# EasyEDA Pro project skyrizz_e32._se050-v1.1.epro, schematic Schematic1_8, sheets 5 to 6 of 6

## Sheets
5 BUTTON & IND: Page Name: BUTTON & IND; Update Date: 2026-05-07
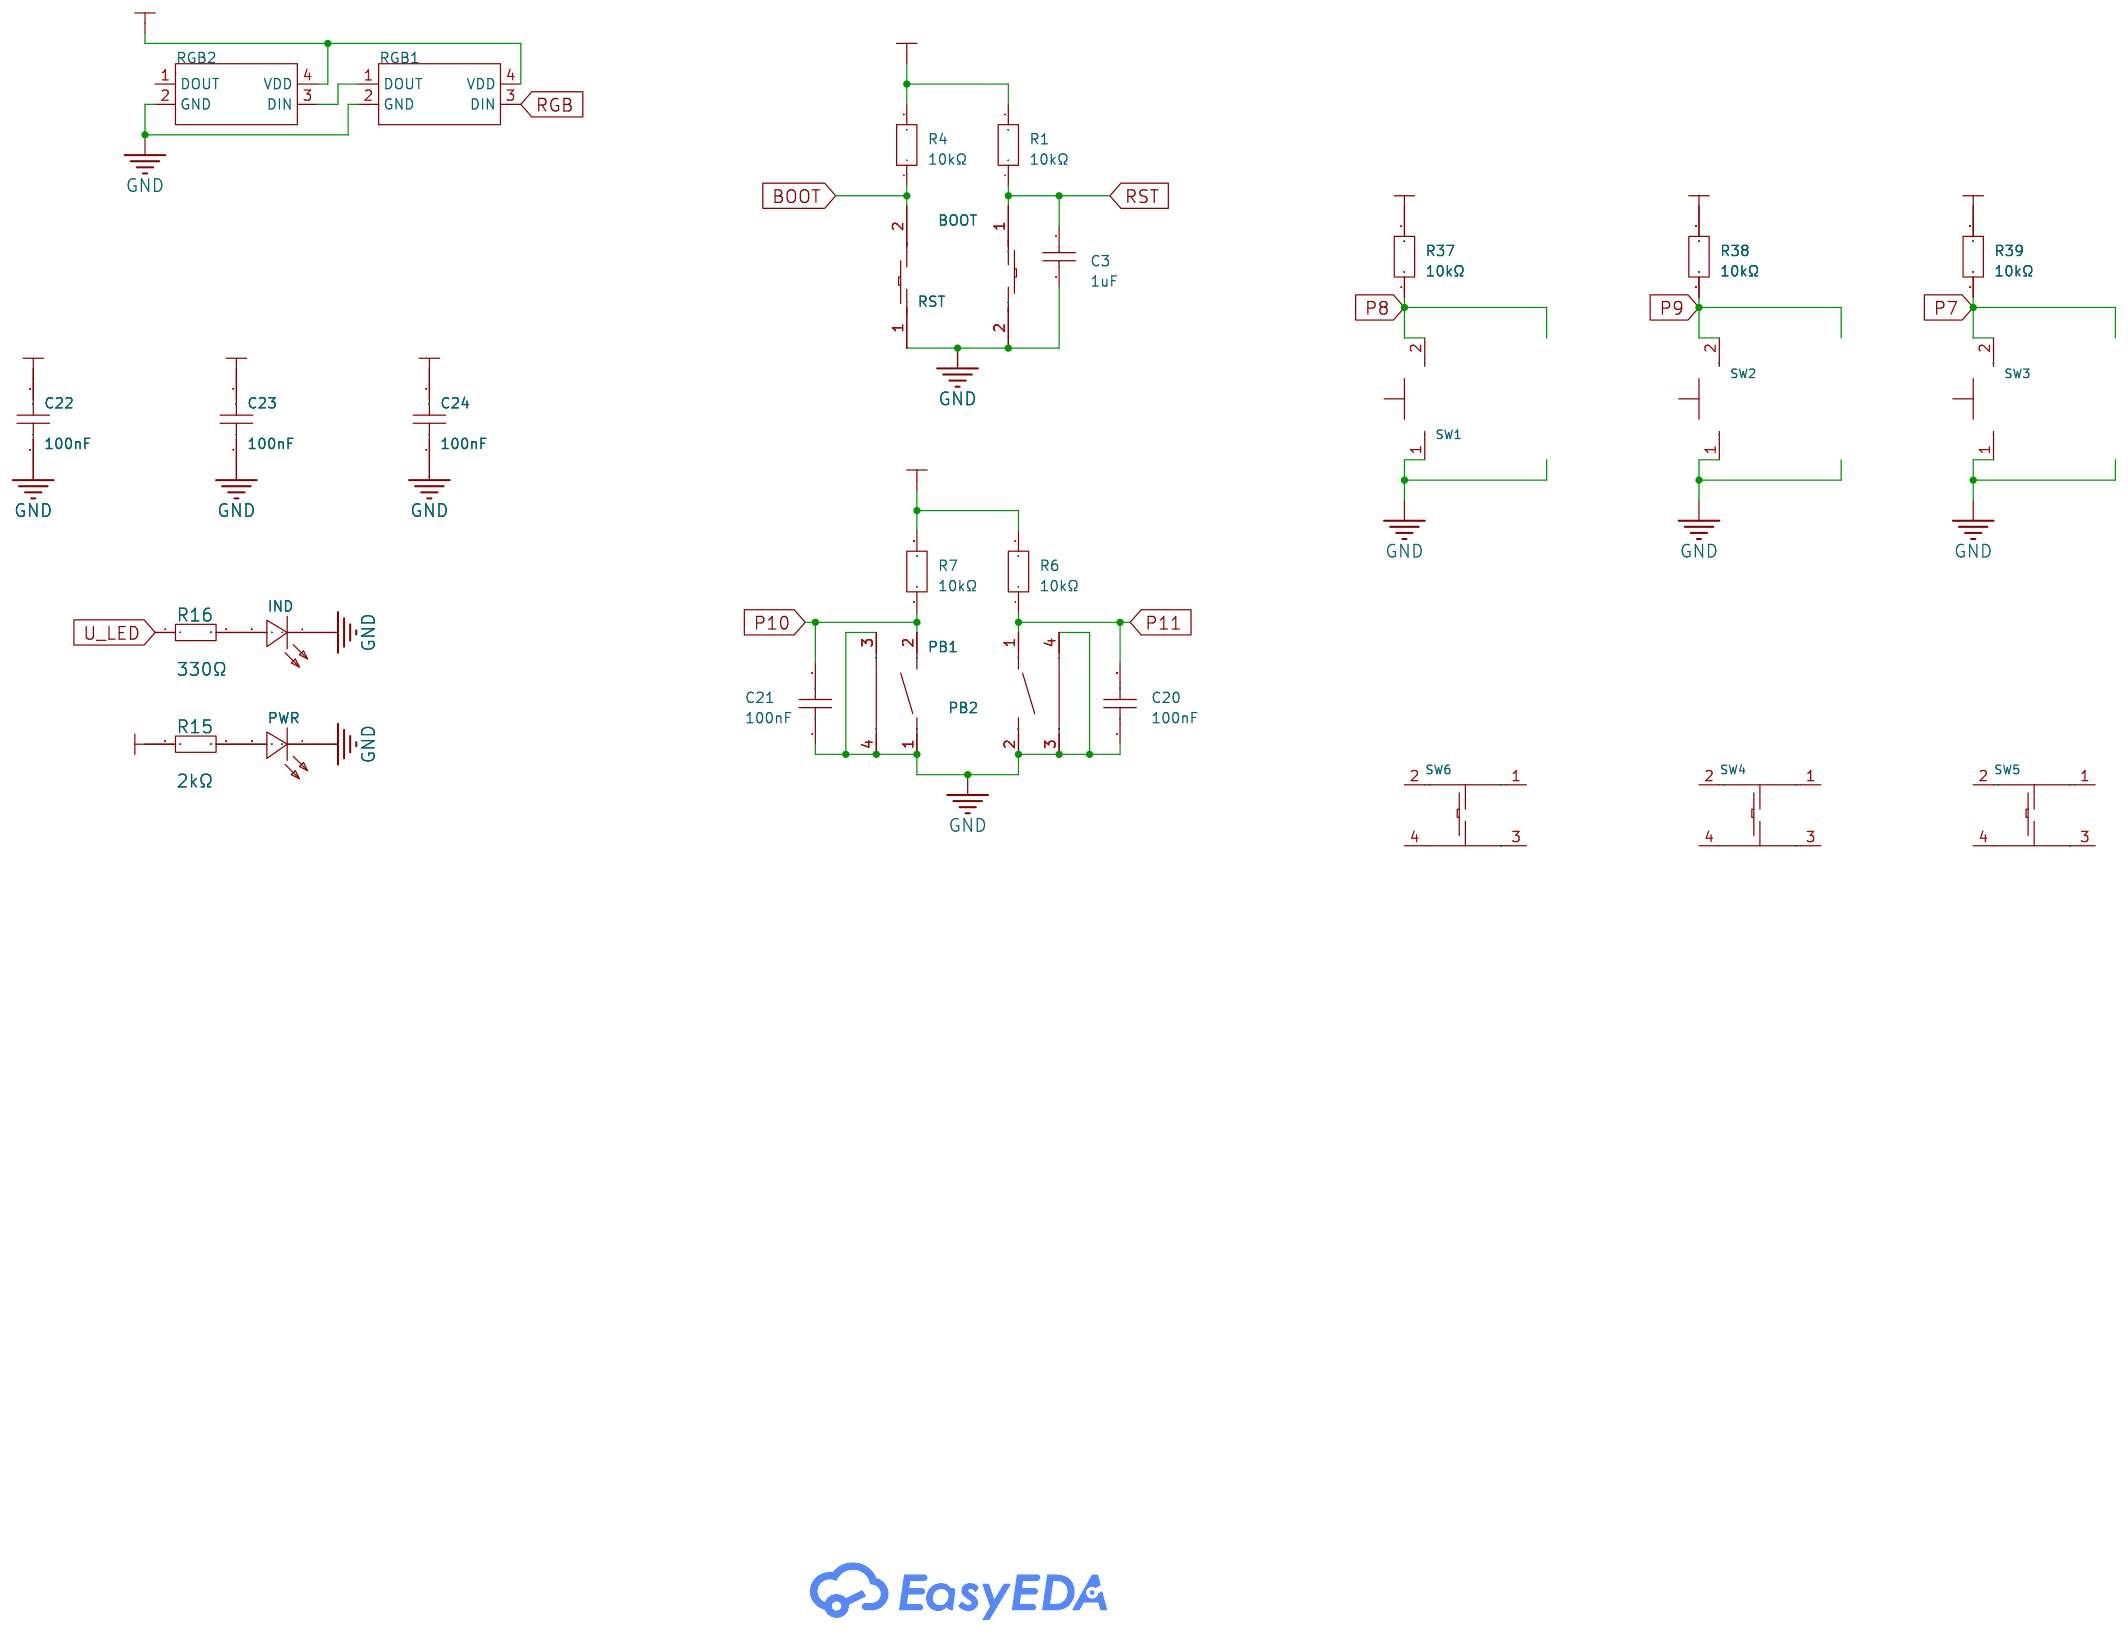
[diagram p4: BUTTON & IND]
6 MIC & SPEAKER: Page Name: MIC & SPEAKER; Update Date: 2026-05-03
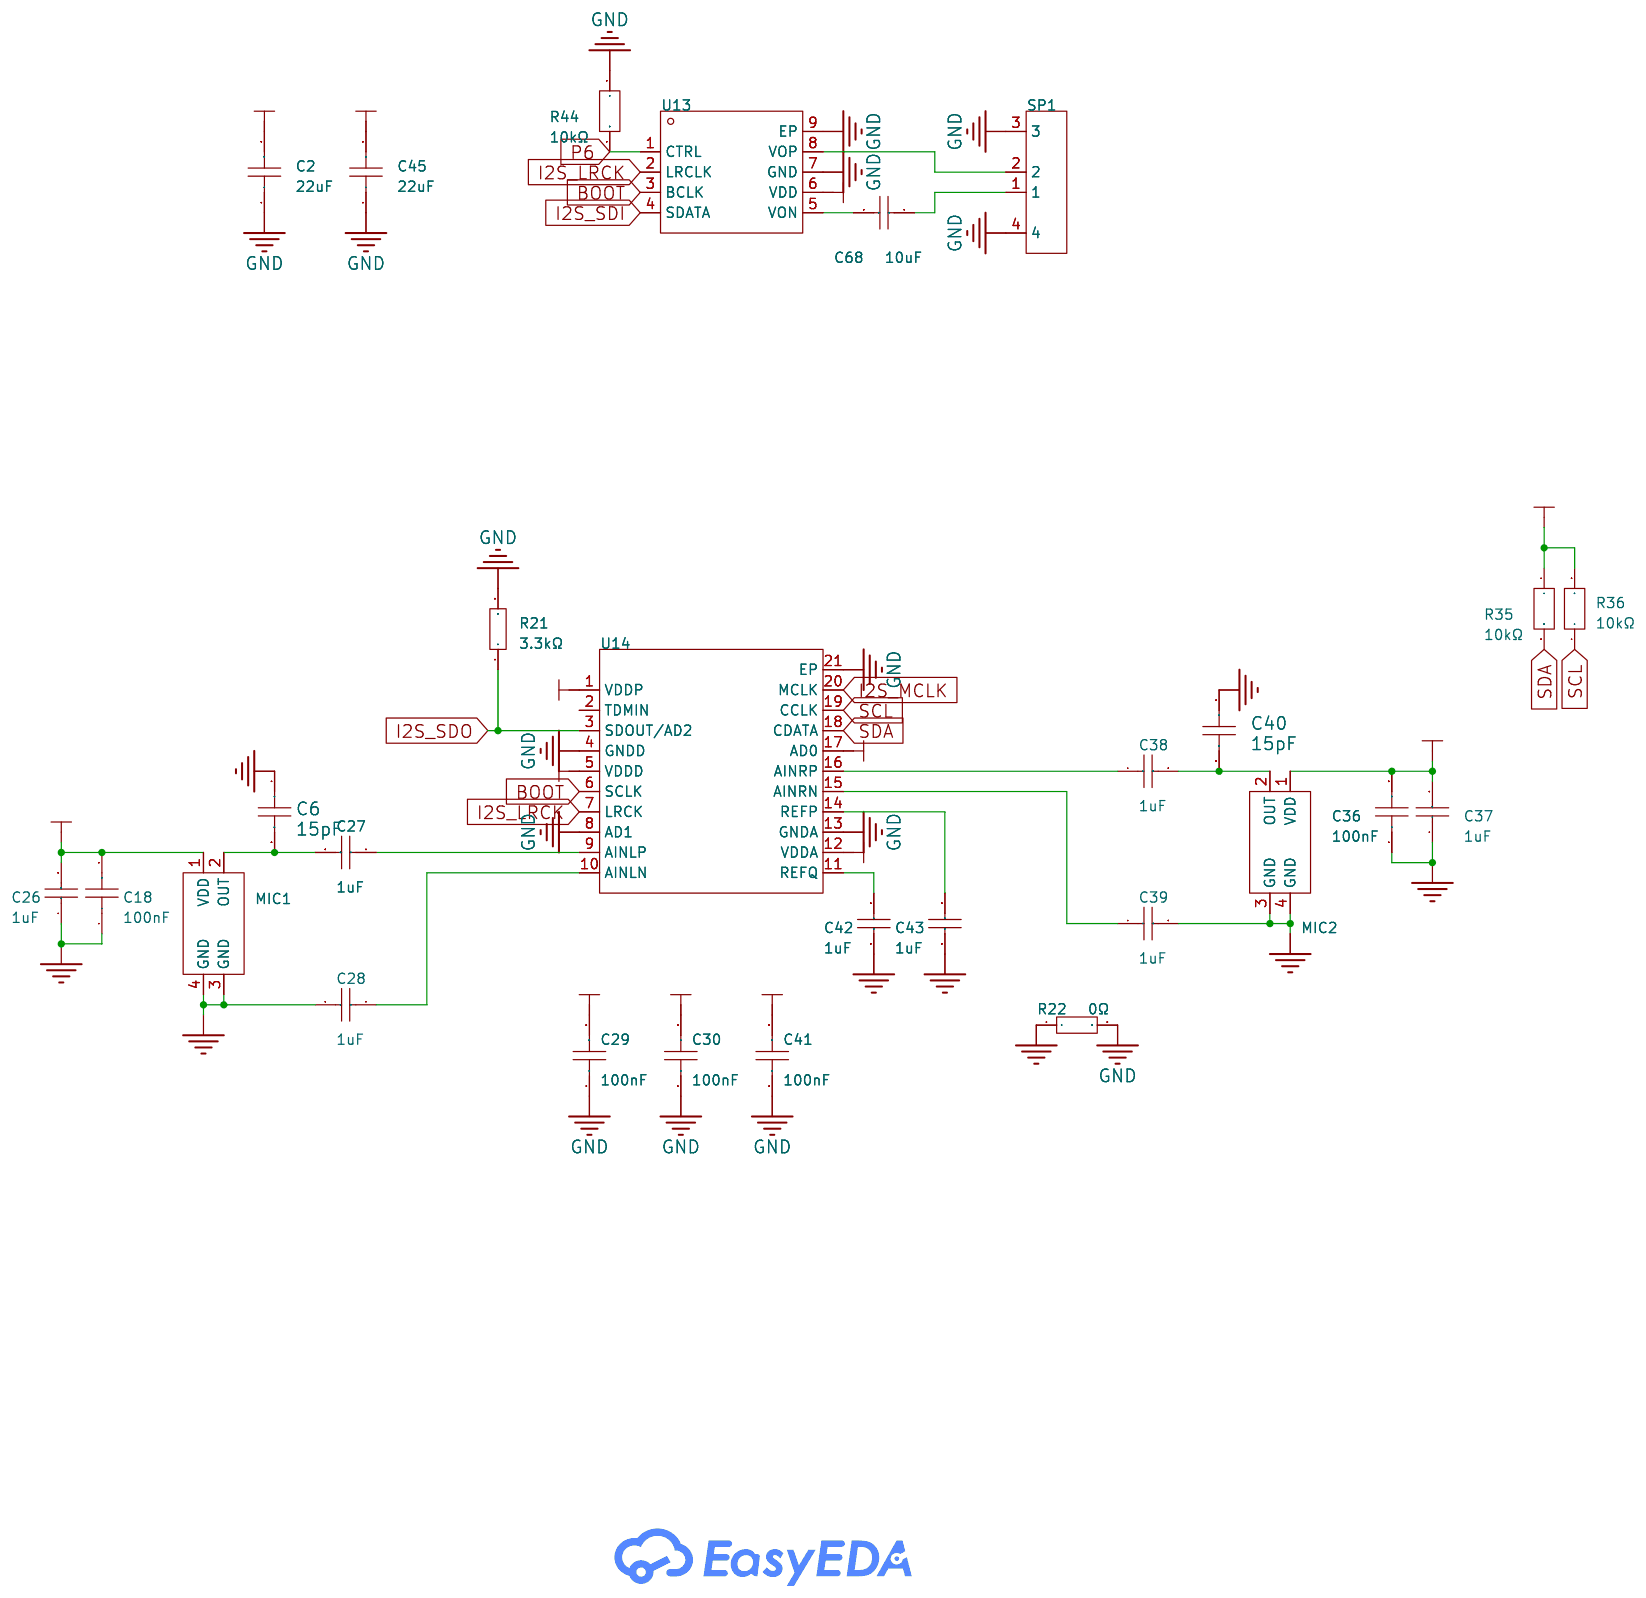
[diagram p5: MIC & SPEAKER]

## Parts
sheet BUTTON & IND
BOOT  B3U-1000P  [KEY-SMD_B3U-1000PM]
C3  1uF  [C0201]
C20  100nF  [C0201]
C21  100nF  [C0201]
C22  100nF  [C0201]
C23  100nF  [C0201]
C24  100nF  [C0201]
IND  KT-0603YG  [LED0603-RD]
PB1  TS24CA  [SW-SMD_2P-TS24CA]
PB2  TS24CA  [SW-SMD_2P-TS24CA]
PWR  KT-0603R  [LED0603-RD]
R1  10kΩ  [R0201]
R4  10kΩ  [R0201]
R6  10kΩ  [R0201]
R7  10kΩ  [R0201]
R15  2kΩ  [R0201]
R16  330Ω  [R0201]
R37  10kΩ  [R0201]
R38  10kΩ  [R0201]
R39  10kΩ  [R0201]
RGB1  XL-0807RGBC-2812B  [LED-SMD_4P-L2.0-W1.8_XL-0807RGBC-WS2812B]
RGB2  XL-0807RGBC-2812B  [LED-SMD_4P-L2.0-W1.8_XL-0807RGBC-WS2812B]
RST  B3U-1000P  [KEY-SMD_B3U-1000PM]
SW1  SKPMAPE010  [KEY-SMD_2P-L6.0-W6.0-P6.00]
SW2  SKPMAPE010  [KEY-SMD_2P-L6.0-W6.0-P6.00]
SW3  SKPMAPE010  [KEY-SMD_2P-L6.0-W6.0-P6.00]
SW4  EVQQ2B03W  [KEY-SMD_4P-L6.5-W6.0-P4.0-LS6.6]  (no BOM)
SW5  EVQQ2B03W  [KEY-SMD_4P-L6.5-W6.0-P4.0-LS6.6]  (no BOM)
SW6  EVQQ2B03W  [KEY-SMD_4P-L6.5-W6.0-P4.0-LS6.6]  (no BOM)
sheet MIC & SPEAKER
C2  22uF  [C0402]
C6  15pF  [C0201]
C18  100nF  [C0201]
C26  1uF  [C0201]
C27  1uF  [C0201]
C28  1uF  [C0201]
C29  100nF  [C0201]
C30  100nF  [C0201]
C36  100nF  [C0201]
C37  1uF  [C0201]
C38  1uF  [C0201]
C39  1uF  [C0201]
C40  15pF  [C0201]
C41  100nF  [C0201]
C42  1uF  [C0201]
C43  1uF  [C0201]
C45  22uF  [C0402]
C68  10uF  [C0402]
MIC1  MSM381ACP003  [MIC-SMD_4P-L2.8-W1.9-TR_MSM381ACP003]
MIC2  MSM381ACP003  [MIC-SMD_4P-L2.8-W1.9-TR_MSM381ACP003]
R21  3.3kΩ  [R0201]
R22  0Ω  [R0603]
R35  10kΩ  [R0201]
R36  10kΩ  [R0201]
R44  10kΩ  [R0201]
SP1  SM02B-SRSS-TB(LF)(SN)  [CONN-SMD_2P-P1.00_SM02B-SRSS-TB-LF-SN]
U13  NS4168  [ESOP-8_L4.9-W3.9-P1.27-LS6.0-BL-EP]
U14  ES7243E  [QFN-20_L3.0-W3.0-P0.40-BL-EP1.7]

## Library data of the parts
BOOT RST = B3U-1000P_C231329: Circuit:SPST Actuator Style:Round Button Operating Force:1.53N Mounting Type:Surface Mount,Vertical Length:3mm Width:2.5mm Switch Height:1.6mm Contact Current:50mA Voltage Rating:12V With Lamp:- Termination Style:SMD(SMT) Tab Life:- Operating Temperature:; LCSC Part Name: 3*2.5*1.6mm 立贴 轻触开关; Supplier Part: C231329; Manufacturer: OMRON(欧姆龙); Supplier Footprint: SMD,2.5x3mm; JLCPCB Part Class: Extended Part; Datasheet: https://item.szlcsc.com/datasheet/B3U-1000P/231216.html; Supplier: LCSC; Circuit: SPST; Actuator Style: Round Button; Operating Force: 1.53N; Mounting Type: Surface Mount,Vertical; Length: 3mm; Width: 2.5mm; Switch Height: 1.6mm; Contact Current: 50mA; Voltage Rating: 12V; Termination Style: SMD(SMT) Tab; Operating Temperature: -25℃~+70℃
C3 C26-C28 C37-C39 C42 C43 = CL03A105MQ3CSNH: Capacitance:1uF Tolerance:±20% Tolerance:±20% Voltage Rating:6.3V Temperature Coefficient:X5R; LCSC Part Name: 1uF ±20% 6.3V; Supplier Part: C53067; Manufacturer: SAMSUNG(三星); Supplier Footprint: 0201; JLCPCB Part Class: Extended Part; Datasheet: https://item.szlcsc.com/datasheet/CL03A105MQ3CSNH/54083.html; Supplier: LCSC; Tolerance: ±20%; Voltage Rating: 6.3V; Temperature Coefficient: X5R
C18 C20-C24 C29 C30 C36 C41 = CL03A104KP3NNNC: Capacitance:100nF Tolerance:±10% Tolerance:±10% Voltage Rating:10V Temperature Coefficient:X5R; LCSC Part Name: 100nF ±10% 10V; Supplier Part: C49062; Manufacturer: SAMSUNG(三星); Supplier Footprint: 0201; JLCPCB Part Class: Extended Part; Datasheet: https://item.szlcsc.com/datasheet/CL03A104KP3NNNC/50070.html; Supplier: LCSC; Tolerance: ±10%; Voltage Rating: 10V; Temperature Coefficient: X5R
IND = KT-0603YG: Lamp Holder Type:- Illumination Color:Yellow Green Voltage - Forward(Vf):2V~2.2V Voltage - Forward(Vf):2V~2.2V Power(Watts):40mW Forward Current:20mA Wavelength - Dominant:567nm~573nm Wavelength - Dominant:567nm~573nm Peak Wavelength:- Diode Configuration; LCSC Part Name: 0603 黄绿 普绿; Supplier Part: C2289; Manufacturer: KENTO; Supplier Footprint: 0603; JLCPCB Part Class: Extended Part; Datasheet: https://item.szlcsc.com/datasheet/KT-0603YG/2662.html; Supplier: LCSC; Illumination Color: Yellow Green; Voltage - Forward(Vf): 2V~2.2V; Power(Watts): 40mW; Forward Current: 20mA; Wavelength - Dominant: 567nm~573nm; Diode Configuration: Discrete Diode; Lens Color: Water Clear; Luminous Intensity: 30mcd~42mcd; Viewing Angle: 120°; Mounting Style: op View Mount; Operating Temperature: -40℃~+85℃
PB1 PB2 = TS24CA: Circuit:SPST Actuator Style:Rectangular Button Mounting Type:Surface Mount, Right Angle Length:4.55mm Width:1.8mm Switch Height:3.5mm Contact Current:50mA Voltage Rating:12V With Lamp:- Life:-; LCSC Part Name: 4.55*1.8*3.5mm 卧贴 轻触开关; Supplier Part: C393942; Manufacturer: SHOU HAN(首韩); Supplier Footprint: SMD,4.6x1.8mm; JLCPCB Part Class: Extended Part; Datasheet: https://item.szlcsc.com/datasheet/TS24CA/372554.html; Supplier: LCSC; Circuit: SPST; Actuator Style: Rectangular Button; Mounting Type: Surface Mount, Right Angle; Length: 4.55mm; Width: 1.8mm; Switch Height: 3.5mm; Contact Current: 50mA; Voltage Rating: 12V
PWR = KT-0603R: Emitted Color:Red Power Dissipation:- Forward Current:- Dominant Wavelength:- Dominant Wavelength:- Peak Wavelength:- Diode Configuration:- Lens Color:- Color Temperature:- Color Temperature:- Viewing Angle:- Mounting Sytle:- Operating Temperature:-40℃~+8; LCSC Part Name: 0603 红灯 高亮; Supplier Part: C2286; Manufacturer: KENTO; Supplier Footprint: 0603; JLCPCB Part Class: Basic Part; Datasheet: https://atta.szlcsc.com/upload/public/pdf/source/20160616/1466072038404.pdf; Supplier: LCSC; Emitted Color: Red; Operating Temperature: -40℃~+85℃
R1 R4 R6 R7 R35-R39 R44 = 0201WMF1002TEE: Type:Thick Film Resistors Resistance:10kΩ Tolerance:±1% Tolerance:±1% Power(Watts): Overload Voltage (Max): Temperature Coefficient:±200ppm/℃ Temperature Coefficient:±200ppm/℃ Operating Temperature Range:-55℃~+155℃ Operating Temperature Range:-55℃~+155℃; LCSC Part Name: 10kΩ ±1% 50mW 厚膜电阻; Supplier Part: C473048; Manufacturer: UNI-ROYAL(厚声); Supplier Footprint: 0201; JLCPCB Part Class: Extended Part; Datasheet: https://atta.szlcsc.com/upload/public/pdf/source/20200306/C422600_1E6D84923E4A46A82E41ADD87F860B5C.pdf; Supplier: LCSC; Type: Thick Film Resistors; Tolerance: ±1%; Temperature Coefficient: ±200ppm/℃; Operating Temperature Range: -55℃~+155℃
R15 = 0201WMF2001TEE: Type:Thick Film Resistor Resistance:2kΩ Tolerance:±1% Tolerance:±1% Power(Watts):50mW Voltage-Supply(Max):25V Temperature Coefficient:±200ppm/℃ Temperature Coefficient:±200ppm/℃ Operating Temperature:-55℃~+155℃ Operating Temperature:-55℃~+155℃; LCSC Part Name: 2kΩ ±1% 50mW 厚膜电阻; Supplier Part: C270358; Manufacturer: UNI-ROYAL(厚声); Supplier Footprint: 0201; JLCPCB Part Class: Extended Part; Datasheet: https://item.szlcsc.com/datasheet/0201WMF2001TEE/259888.html; Supplier: LCSC; Type: Thick Film Resistor; Tolerance: ±1%; Power(Watts): 50mW; Voltage-Supply(Max): 25V; Temperature Coefficient: ±200ppm/℃; Operating Temperature: -55℃~+155℃
R16 = 0201WMJ0331TEE: Type:Thick Film Resistors Resistance: Tolerance:±5% Tolerance:±5% Power(Watts): Overload Voltage (Max): Temperature Coefficient:±200ppm/℃ Temperature Coefficient:±200ppm/℃ Operating Temperature Range:-55℃~+155℃ Operating Temperature Range:-55℃~+155℃; LCSC Part Name: 330Ω ±5% 50mW 厚膜电阻; Supplier Part: C473445; Manufacturer: UNI-ROYAL(厚声); Supplier Footprint: 0201; JLCPCB Part Class: Extended Part; Datasheet: https://atta.szlcsc.com/upload/public/pdf/source/20200306/C422600_1E6D84923E4A46A82E41ADD87F860B5C.pdf; Supplier: LCSC; Type: Thick Film Resistors; Tolerance: ±5%; Temperature Coefficient: ±200ppm/℃; Operating Temperature Range: -55℃~+155℃
RGB1 RGB2 = XL-0807RGBC-2812B: Wavelength:R:620nm~630nm；G:520nm~530nm；B:460nm~475nm Luminous Intensity:R:200mcd；G:800mcd；B:300mcd Fixed-Frequency Pwm Mode:4.5kHz Data Transmission Rate:800Kbit/s Voltage - Supply:4V~5.5V Voltage - Supply:4V~5.5V Quiescent Current:0.35mA Lens Color:Water; LCSC Part Name: XL-0807RGBC-WS2812B; Supplier Part: C3646929; Manufacturer: XINGLIGHT(成兴光); Supplier Footprint: SMD-4P,2x1.8mm; JLCPCB Part Class: Extended Part; Datasheet: https://item.szlcsc.com/datasheet/XL-0807RGBC-2812B/4213772.html; Supplier: LCSC; Wavelength: R:620nm~630nm；G:520nm~530nm；B:460nm~475nm; Luminous Intensity: R:200mcd；G:800mcd；B:300mcd; Fixed-Frequency Pwm Mode: 4.5kHz; Data Transmission Rate: 800Kbit/s; Voltage - Supply: 4V~5.5V; Quiescent Current: 0.35mA; Lens Color: Water Clear; ESD Withstand Voltage: 3000V; Installation method: op View Mount; Operating Temperature: -20℃~+85℃; Peak Wavelength: R:625nm；B:470nm；G:525nm; Viewing Angle: 120°; Length: 2mm; Width: 0.8mm; Height: 1.8mm
SW1-SW3 = SKPMAPE010_C110292: Circuit:SPST Actuator Style:Round Button Mounting Style:Brick nogging Switch Length:6mm Switch Width:5.9mm Switch Height:5mm Contact Current:50mA Voltage Rating (DC):16V With Lamp:- Mechanical Life:-; LCSC Part Name: 6*5.9*5mm 立贴 轻触开关; Supplier Part: C110292; Manufacturer: ALPSALPINE(阿尔卑斯阿尔派); Supplier Footprint: SMD; JLCPCB Part Class: Extended Part; Datasheet: https://atta.szlcsc.com/upload/public/pdf/source/20170428/1493376812340.pdf; Supplier: LCSC; Circuit: SPST; Actuator Style: Round Button; Mounting Style: Brick nogging; Switch Length: 6mm; Switch Width: 5.9mm; Switch Height: 5mm; Contact Current: 50mA; Voltage Rating (DC): 16V
SW4-SW6 = EVQQ2B03W: Circuit:SPST Actuator Style:Round Button Operating Force:0.5N Mounting Style:Brick nogging Switch Length:6.5mm Switch Width:6mm Switch Height:3.1mm Contact Current:20mA Voltage Rating (AC):- Voltage Rating (DC):15V Power Rating:- Insulation Resistance:100; LCSC Part Name: 6.5*6*3.1mm 立贴 轻触开关; Supplier Part: C79178; Manufacturer: PANASONIC(松下); Supplier Footprint: SMD,6x6.5mm; JLCPCB Part Class: Extended Part; Datasheet: https://atta.szlcsc.com/upload/public/pdf/source/20160718/1468827520784.pdf; Supplier: LCSC; Circuit: SPST; Actuator Style: Round Button; Operating Force: 0.5N; Mounting Style: Brick nogging; Switch Length: 6.5mm; Switch Width: 6mm; Switch Height: 3.1mm; Contact Current: 20mA; Voltage Rating (DC): 15V; Insulation Resistance: 100MΩ; Pin Style: J pin; Mechanical Life: 200万次; Operating Temperature: -40℃~+85℃
C2 C45 = CL05A226MQ5QUNC: Capacitance:22uF Tolerance:±20% Tolerance:±20% Voltage Rating:6.3V Temperature Coefficient:X5R; LCSC Part Name: 22uF ±20% 6.3V; Supplier Part: C105226; Manufacturer: SAMSUNG(三星); Supplier Footprint: 0402; JLCPCB Part Class: Extended Part; Datasheet: https://item.szlcsc.com/datasheet/CL05A226MQ5QUNC/106441.html; Supplier: LCSC; Tolerance: ±20%; Voltage Rating: 6.3V; Temperature Coefficient: X5R
C6 C40 = GRM0335C1H150JA01D: Capacitance:15pF Tolerance:±5% Tolerance:±5% Voltage Rating:50V Temperature Coefficient:C0G; LCSC Part Name: 15pF ±5% 50V; Supplier Part: C85891; Manufacturer: muRata(村田); Supplier Footprint: 0201; JLCPCB Part Class: Extended Part; Datasheet: https://item.szlcsc.com/datasheet/GRM0335C1H150JA01D/87067.html; Supplier: LCSC; Tolerance: ±5%; Voltage Rating: 50V; Temperature Coefficient: C0G
C68 = CL05A106MQ5NUNC: Capacitance:10uF Tolerance:±20% Tolerance:±20% Voltage Rating:6.3V Temperature Coefficient:X5R; LCSC Part Name: 10uF ±20% 6.3V; Supplier Part: C15525; Manufacturer: SAMSUNG(三星); Supplier Footprint: 0402; JLCPCB Part Class: Basic Part; Datasheet: https://item.szlcsc.com/datasheet/CL05A106MQ5NUNC/16204.html; Supplier: LCSC; Tolerance: ±20%; Voltage Rating: 6.3V; Temperature Coefficient: X5R
MIC1 MIC2 = MSM381ACP003_C51928212: Direction:Omnidirectional Voltage - Supply:1.8V Voltage - Supply:1.8V Current Consumption:175uA Current Consumption:175uA S/N Ratio:64dB Sensitivity:-38dB Sensitivity:-38dB Impedance:170Ω Output Type:Analog output Length:2.75mm Width:1.85mm Height:1mm; Supplier Part: C51928212; Manufacturer: MEMS(敏芯微); Supplier Footprint: LGA-4(1.9x2.8); JLCPCB Part Class: Extended Part; Datasheet: https://item.szlcsc.com/datasheet/MSM381ACP003/54640767.html; Supplier: LCSC; Direction: Omnidirectional; Voltage - Supply: 1.8V; Current Consumption: 175uA; S/N Ratio: 64dB; Sensitivity: -38dB; Impedance: 170Ω; Output Type: Analog output; Length: 2.75mm; Width: 1.85mm; Height: 1mm
R21 = 0201WMF3301TEE: Type:Thick Film Resistor Resistance:3.3kΩ Tolerance:±1% Tolerance:±1% Power(Watts):50mW Voltage-Supply(Max):25V Temperature Coefficient:±200ppm/℃ Temperature Coefficient:±200ppm/℃ Operating Temperature:-55℃~+155℃ Operating Temperature:-55℃~+155℃; LCSC Part Name: 3.3kΩ ±1% 50mW 厚膜电阻; Supplier Part: C270350; Manufacturer: UNI-ROYAL(厚声); Supplier Footprint: 0201; JLCPCB Part Class: Extended Part; Datasheet: https://item.szlcsc.com/datasheet/0201WMF3301TEE/259880.html; Supplier: LCSC; Type: Thick Film Resistor; Tolerance: ±1%; Power(Watts): 50mW; Voltage-Supply(Max): 25V; Temperature Coefficient: ±200ppm/℃; Operating Temperature: -55℃~+155℃
R22 = 0603WAF0000T5E: Type:Thick Film Resistor Resistance:0Ω Tolerance:±1% Tolerance:±1% Power(Watts):100mW Voltage-Supply(Max):75V Temperature Coefficient:- Temperature Coefficient:- Operating Temperature:-55℃~+155℃ Operating Temperature:-55℃~+155℃; LCSC Part Name: 0Ω ±1% 100mW 厚膜电阻; Supplier Part: C21189; Manufacturer: UNI-ROYAL(厚声); Supplier Footprint: 0603; JLCPCB Part Class: Basic Part; Datasheet: https://item.szlcsc.com/datasheet/0603WAF0000T5E/21903.html; Supplier: LCSC; Type: Thick Film Resistor; Tolerance: ±1%; Power(Watts): 100mW; Voltage-Supply(Max): 75V; Operating Temperature: -55℃~+155℃
SP1 = SM02B-SRSS-TB(LF)(SN): Pins Structure:1x2P Pitch:1mm Mounting Type:Surface Mount, Right Angle Reference Series:SH Number of Pins:2P Number of Rows:1 Number of PINs Per Row:2 Row Spacing:- Current Rating:1A Contact Material:Copper Alloy Contact Plating:Tin Operating Temperature:; LCSC Part Name: 1x2P 间距:1mm 卧贴 系列:SH; Supplier Part: C160402; Manufacturer: JST; Supplier Footprint: SMD,P=1mm,卧贴; JLCPCB Part Class: Extended Part; Datasheet: https://item.szlcsc.com/datasheet/SM02B-SRSS-TB(LF)(SN)/171782.html; Supplier: LCSC; Pins Structure: 1x2P; Pitch: 1mm; Mounting Type: Surface Mount, Right Angle; Reference Series: SH; Number of Pins: 2P; Number of Rows: 1; Number of PINs Per Row: 2; Current Rating: 1A; Contact Material: Copper Alloy; Contact Plating: Tin; Operating Temperature: -25℃~+85℃; Voltage Rating: 50V; Plastic Material: PA; Flame Retardant Rating: UL94V-0; Supplementary Features: Auxiliary Solder Pin; Color: White; Z-Height of the Board: 2.9mm; X-Length of Bottom Edge on Board (Spacing Line): 4mm; Y-Width of Bottom Edge on Board: 4.32mm
U13 = NS4168_C910588: Class:Class D Output Power:2.5Wx1@4Ω Voltage - Supply:3V~5.5V Voltage - Supply:3V~5.5V; Supplier Part: C910588; Manufacturer: Nsiway(纳芯威); Supplier Footprint: ESOP-8-EP(3.9x4.9x1.27); JLCPCB Part Class: Extended Part; Datasheet: https://item.szlcsc.com/datasheet/NS4168/978904.html; Supplier: LCSC; Class: Class D; Output Power: 2.5Wx1@4Ω; Voltage - Supply: 3V~5.5V
U14 = ES7243E: Resolution:24 Number of Channels:16 Voltage - Supply:1.7V~3.6V Voltage - Supply:1.7V~3.6V Interface Type:I2S Chip Type Parameters/Description:Stereo Audio ADC Operating Temperature:-40℃~+85℃ Operating Temperature:-40℃~+85℃; Supplier Part: C2929446; Manufacturer: Everest-semi(顺芯); Supplier Footprint: QFN-20; JLCPCB Part Class: Extended Part; Datasheet: https://item.szlcsc.com/datasheet/ES7243E/3264523.html; Supplier: LCSC; Resolution: 24; Number of Channels: 16; Voltage - Supply: 1.7V~3.6V; Interface Type: I2S; Chip Type Parameters/Description: Stereo Audio ADC; Operating Temperature: -40℃~+85℃

## Nets
3V3: C2.2 C18.2 C22.2 C23.2 C24.2 C26.2 C29.2 C30.2 C36.2 C37.2 C41.2 C45.2 MIC1.1(VDD) MIC2.1(VDD) R1.2 R4.2 R6.2 R7.2 R15.2 R35.1 R36.2 R37.2 R38.2 R39.2 RGB1.4(VDD) RGB2.4(VDD) U13.6(VDD) U14.1(VDDP) U14.5(VDDD) U14.12(VDDA) U14.17(AD0) ; also on sheet 1 2 3 4
AGND: C6.1 C18.1 C26.1 C28.2 C36.1 C37.1 C39.2 C40.1 C42.1 C43.1 MIC1.3(GND) MIC1.4(GND) MIC2.3(GND) MIC2.4(GND) R22.1
GND: BOOT.1 C2.1 C3.1 C20.1 C21.1 C22.1 C23.1 C24.1 C29.1 C30.1 C41.1 C45.1 IND.1(K) PB1.1 PB1.3 PB1.4 PB2.2 PB2.3 PB2.4 PWR.1(K) R21.2 R22.2 R44.1 RGB1.2(GND) RGB2.2(GND) RST.2 SP1.3 SP1.4 SW1.1 SW2.1 SW3.1 U13.7(GND) U13.9(EP) U14.4(GNDD) U14.8(AD1) U14.13(GNDA) U14.21(EP) ; also on sheet 1 2 3 4
BOOT: BOOT.2 R4.1 U13.3(BCLK) U14.6(SCLK) ; also on sheet 1
I2S_LRCK: U13.2(LRCLK) U14.7(LRCK) ; also on sheet 1
I2S_MCLK: U14.20(MCLK) ; also on sheet 1
I2S_SDI: U13.4(SDATA) ; also on sheet 1
I2S_SDO: R21.1 U14.3(SDOUT/AD2) ; also on sheet 1
P6: R44.2 U13.1(CTRL) ; also on sheet 3
P7: R39.1 SW3.2 ; also on sheet 3
P8: R37.1 SW1.2 ; also on sheet 3
P9: R38.1 SW2.2 ; also on sheet 3
P10: C21.2 PB1.2 R7.1 ; also on sheet 3
P11: C20.2 PB2.1 R6.1 ; also on sheet 3
RGB: RGB1.3(DIN) ; also on sheet 1
RST: C3.2 R1.1 RST.1 ; also on sheet 1
SCL: R36.1 U14.19(CCLK) ; also on sheet 1 3 4
SDA: R35.2 U14.18(CDATA) ; also on sheet 1 3 4
U_LED: R16.1 ; also on sheet 3
$5N1165: PWR.2(A) R15.1
$5N1166: IND.2(A) R16.2
$5N3637: RGB1.1(DOUT) RGB2.3(DIN)
$6N1541: C6.2 C27.2 MIC1.2(OUT)
$6N1543: C27.1 U14.9(AINLP)
$6N1544: C28.1 U14.10(AINLN)
$6N1560: C38.2 C40.2 MIC2.2(OUT)
$6N1562: C39.1 U14.15(AINRN)
$6N1563: C38.1 U14.16(AINRP)
$6N1575: C42.2 U14.11(REFQ)
$6N1576: C43.2 U14.14(REFP)
$6N3567: C68.2 U13.5(VON)
Net-(C68-1): C68.1 SP1.1
Net-(SP1-2): SP1.2 U13.8(VOP)

Not connected (* = marked no-connect by the designer): RGB2 1(DOUT); SW4 1 2 3 4; SW5 1 2 3 4; SW6 1 2 3 4; U14 2(TDMIN)
